# Altium schematic sheet 5-POWER.SchDoc
size A3
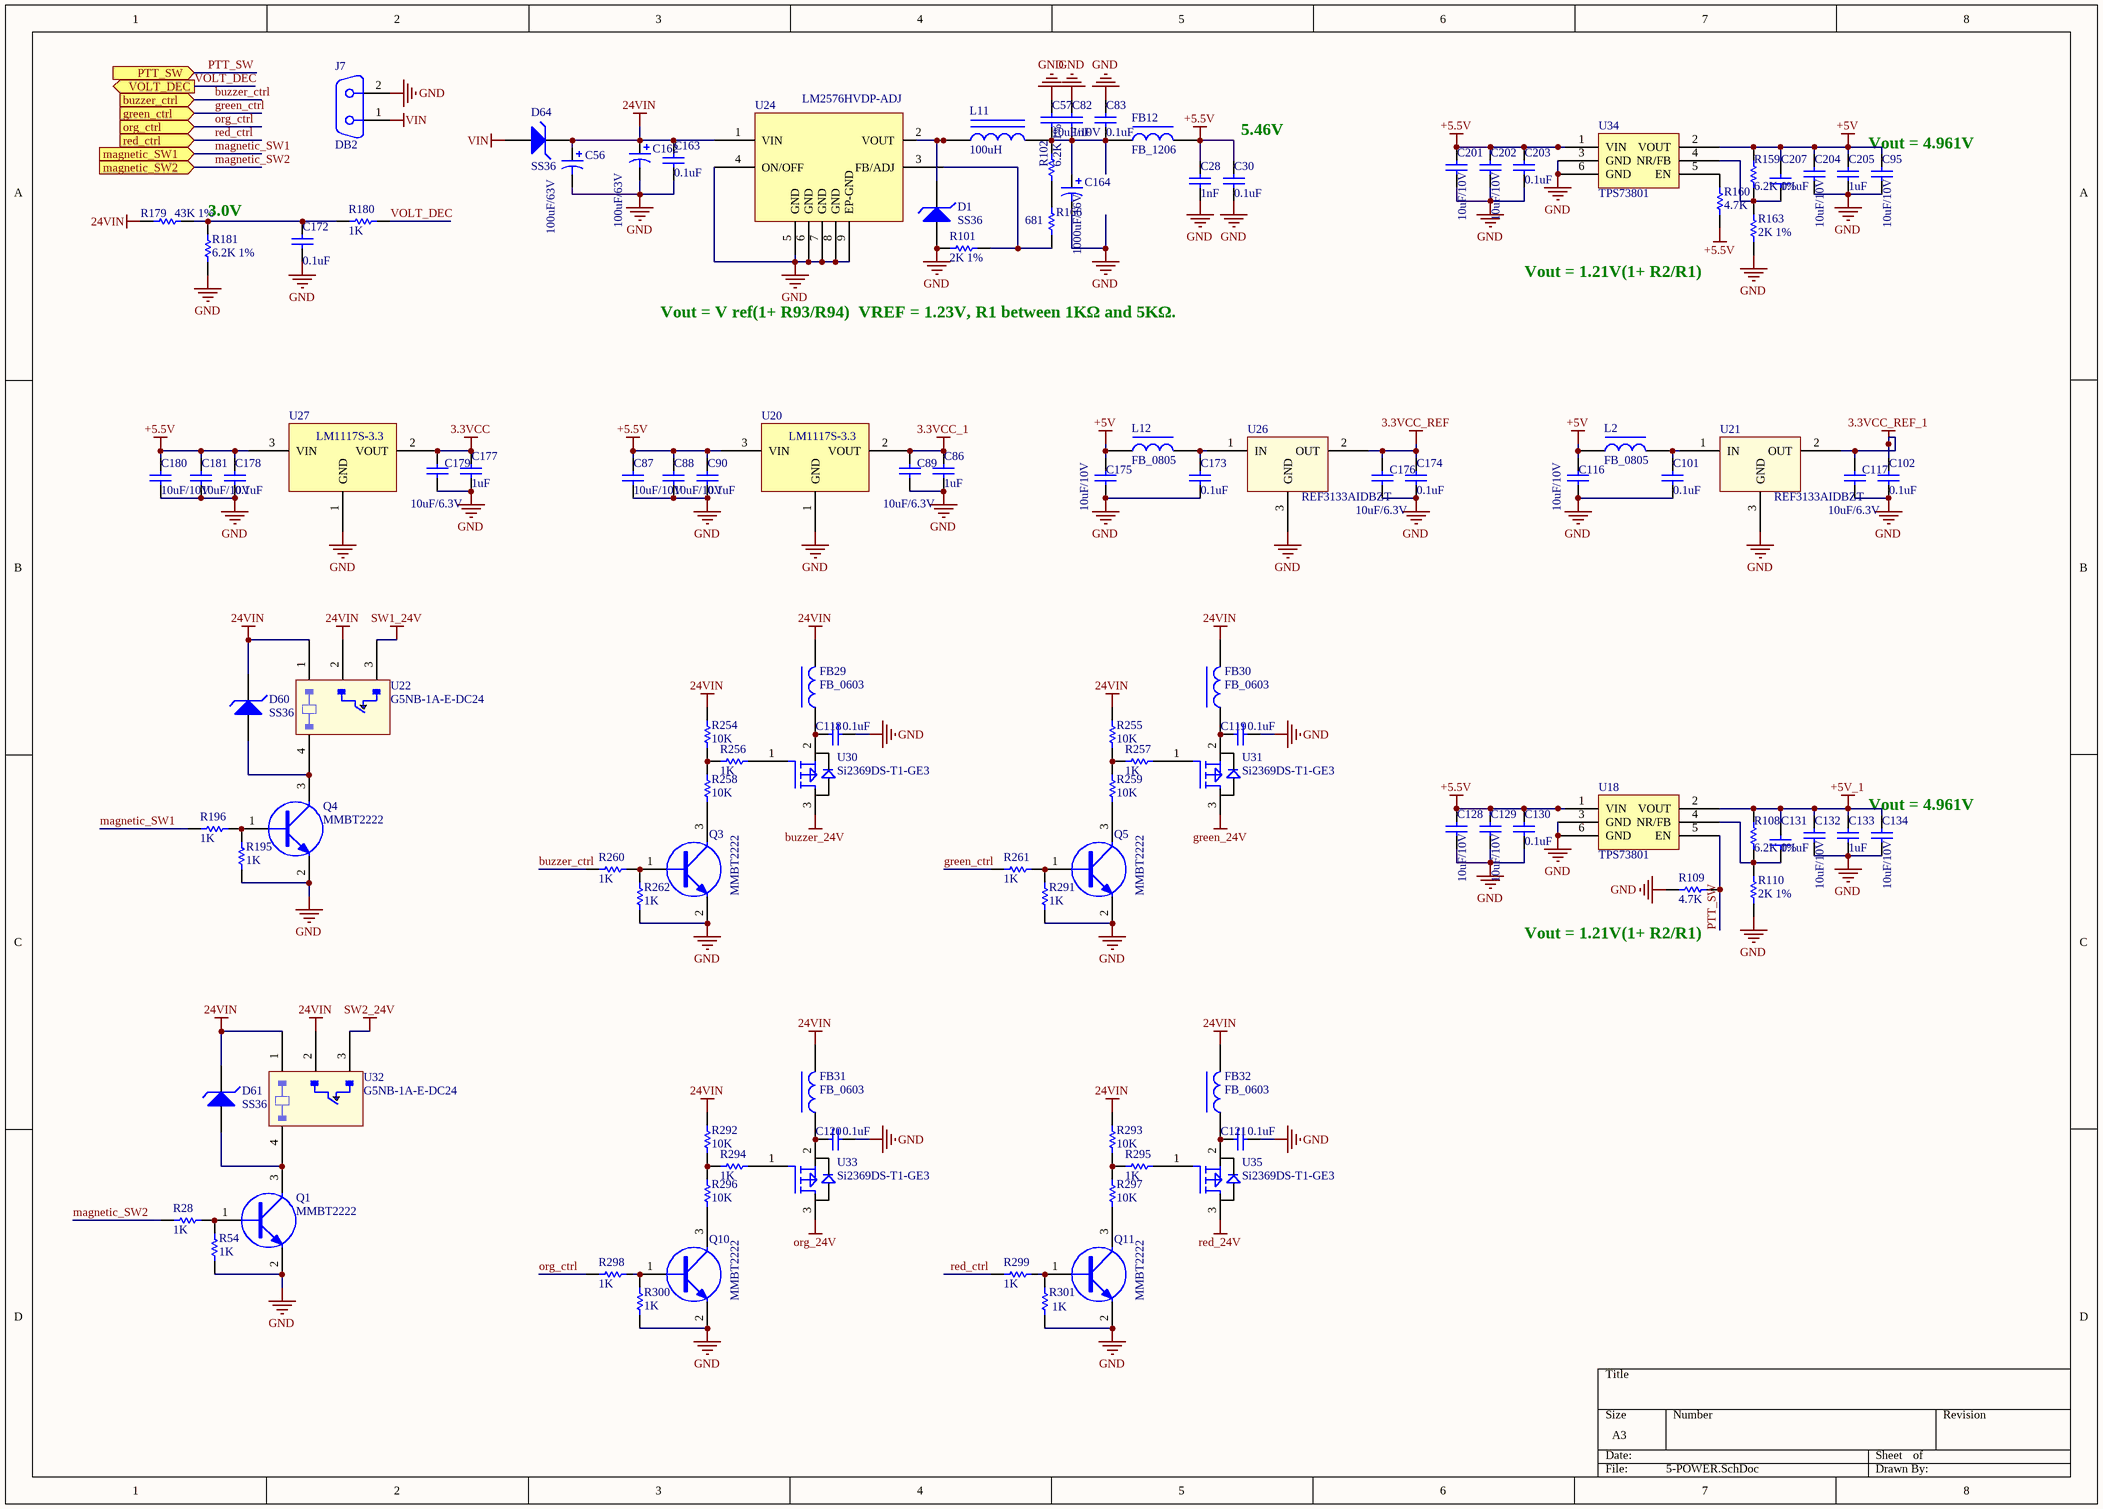
[diagram p0: 5-POWER.SchDoc]

## Parts
C28  1nF  [C0603]
C30  0.1uF  [C0603]
C56  100uF/63V  [ECAP2SM_10R4x10R4]
C57  10uF/10V  [C0805]
C82  1nF  [C0603]
C83  0.1uF  [C0603]
C86  1uF  [C0603]
C87  10uF/10V  [C0805]
C88  10uF/10V  [C0805]
C89  10uF/6.3V  [C0603]
C90  0.1uF  [C0603]
C95  10uF/10V  [C0805]
C101  0.1uF  [C0603]
C102  0.1uF  [C0603]
C116  10uF/10V  [C0805]
C117  10uF/6.3V  [C0603]
C118  0.1uF  [C0603]
C119  0.1uF  [C0603]
C120  0.1uF  [C0603]
C121  0.1uF  [C0603]
C128  10uF/10V  [C0805]
C129  10uF/10V  [C0805]
C130  0.1uF  [C0603]
C131  0.1uF  [C0603]
C132  10uF/10V  [C0805]
C133  1uF  [C0603]
C134  10uF/10V  [C0805]
C162  100uF/63V  [ECAP2SM_10R4x10R4]
C163  0.1uF  [C0603]
C164  1000uF/16V  [ECAP2SM_10R4x10R4]
C172  0.1uF  [C0603]
C173  0.1uF  [C0603]
C174  0.1uF  [C0603]
C175  10uF/10V  [C0805]
C176  10uF/6.3V  [C0603]
C177  1uF  [C0603]
C178  0.1uF  [C0603]
C179  10uF/6.3V  [C0603]
C180  10uF/10V  [C0805]
C181  10uF/10V  [C0805]
C201  10uF/10V  [C0805]
C202  10uF/10V  [C0805]
C203  0.1uF  [C0603]
C204  10uF/10V  [C0805]
C205  1uF  [C0603]
C207  0.1uF  [C0603]
D1  SS36  [DO-214AC]
D60  SS36  [DO-214AC]
D61  SS36  [DO-214AC]
D64  SS36  [DO-214AC]
FB12  FB_1206  [L1206]
FB29  FB_0603  [L0603]
FB30  FB_0603  [L0603]
FB31  FB_0603  [L0603]
FB32  FB_0603  [L0603]
J7  DB2  [DB2TM-VM]  (no BOM)
L2  FB_0805  [L0805]
L11  100uH  [PL2SM-12R5x12R5]
L12  FB_0805  [L0805]
Q1  MMBT2222  [SOT23-3]
Q3  MMBT2222  [SOT23-3]
Q4  MMBT2222  [SOT23-3]
Q5  MMBT2222  [SOT23-3]
Q10  MMBT2222  [SOT23-3]
Q11  MMBT2222  [SOT23-3]
R28  1K  [R0603]
R54  1K  [R0603]
R101  2K 1%  [R0603]
R102  6.2K 1%  [R0603]
R108  6.2K 1%  [R0603]
R109  4.7K  [R0603]
R110  2K 1%  [R0603]
R159  6.2K 1%  [R0603]
R160  4.7K  [R0603]
R163  2K 1%  [R0603]
R166  681  [R0603]
R179  43K 1%  [R0603]
R180  1K  [R0603]
R181  6.2K 1%  [R0603]
R195  1K  [R0603]
R196  1K  [R0603]
R254  10K  [R0603]
R255  10K  [R0603]
R256  1K  [R0603]
R257  1K  [R0603]
R258  10K  [R0603]
R259  10K  [R0603]
R260  1K  [R0603]
R261  1K  [R0603]
R262  1K  [R0603]
R291  1K  [R0603]
R292  10K  [R0603]
R293  10K  [R0603]
R294  1K  [R0603]
R295  1K  [R0603]
R296  10K  [R0603]
R297  10K  [R0603]
R298  1K  [R0603]
R299  1K  [R0603]
R300  1K  [R0603]
R301  1K  [R0603]
U18  TPS73801  [SOT-223-6]
U20  LM1117S-3.3  [SOT-223]
U21  REF3133AIDBZT  [SOT23-3]
U22  G5NB-1A-E-DC24  [G5NB-1A-E-DC24-20R4X7]
U24  LM2576HVDP-ADJ  [SOIC8_1R27_3R9x4R9-1]
U26  REF3133AIDBZT  [SOT23-3]
U27  LM1117S-3.3  [SOT-223]
U30  Si2369DS-T1-GE3  [SOT23-3]
U31  Si2369DS-T1-GE3  [SOT23-3]
U32  G5NB-1A-E-DC24  [G5NB-1A-E-DC24-20R4X7]
U33  Si2369DS-T1-GE3  [SOT23-3]
U34  TPS73801  [SOT-223-6]
U35  Si2369DS-T1-GE3  [SOT23-3]

## Ports
buzzer_ctrl (in), green_ctrl (in), magnetic_SW1 (in), magnetic_SW2 (in), org_ctrl (in), PTT_SW (in), red_ctrl (in), VOLT_DEC (out)

## Nets
3.3VCC: C177.2 C179.2 U27.2(VOUT)
3.3VCC_1: C86.2 C89.2 U20.2(VOUT)
3.3VCC_REF: C174.2 C176.2 U26.2(OUT)
3.3VCC_REF_1: C102.2 C117.2 U21.2(OUT)
24VIN: C56.1 C162.1 C163.2 D60.2(K) D61.2(K) D64.2(K) FB29.2 FB30.2 FB31.2 FB32.2 R179.1 R254.2 R255.2 R292.2 R293.2 U22.1 U22.2 U24.1(VIN) U32.1 U32.2
+5.5V: C28.2 C30.2 C87.2 C88.2 C90.2 C128.2 C129.2 C130.2 C178.2 C180.2 C181.2 C201.2 C202.2 C203.2 FB12.2 R160.2 U18.1(VIN) U20.3(VIN) U27.3(VIN) U34.1(VIN)
+5V: C95.2 C116.2 C175.2 C204.2 C205.2 C207.2 L2.1 L12.1 R159.2 U34.2(VOUT)
+5V_1: C131.2 C132.2 C133.2 C134.2 R108.2 U18.2(VOUT)
buzzer_24V: U30.3(D)
GND: C28.1 C30.1 C56.2 C57.2 C82.2 C83.2 C86.1 C87.1 C88.1 C89.1 C90.1 C95.1 C101.1 C102.1 C116.1 C117.1 C118.1 C119.1 C120.1 C121.1 C128.1 C129.1 C130.1 C132.1 C133.1 C134.1 C162.2 C163.1 C164.2 C172.1 C173.1 C174.1 C175.1 C176.1 C177.1 C178.1 C179.1 C180.1 C181.1 C201.1 C202.1 C203.1 C204.1 C205.1 D1.1(A) J7.2 Q1.2(E) Q3.2(E) Q4.2(E) Q5.2(E) Q10.2(E) Q11.2(E) R54.1 R101.2 R109.1 R110.1 R163.1 R181.1 R195.1 R262.2 R291.2 R300.2 R301.2 U18.3(GND) U18.6(GND) U20.1(GND) U21.3(GND) U24.4(ON/OFF) U24.5(GND) U24.6(GND) U24.7(GND) U24.8(GND) U24.9(EP-GND) U26.3(GND) U27.1(GND) U34.3(GND) U34.6(GND)
green_24V: U31.3(D)
org_24V: U33.3(D)
red_24V: U35.3(D)
SW1_24V: U22.3
SW2_24V: U32.3
VIN: D64.1(A) J7.1
buzzer_ctrl: R260.1 ; port buzzer_ctrl
green_ctrl: R261.1 ; port green_ctrl
magnetic_SW1: R196.1 ; port magnetic_SW1
magnetic_SW2: R28.1 ; port magnetic_SW2
org_ctrl: R298.1 ; port org_ctrl
PTT_SW: R109.2 U18.5(EN) ; port PTT_SW
red_ctrl: R299.1 ; port red_ctrl
VOLT_DEC: R180.1 ; port VOLT_DEC
NetC57_1: C57.1 C82.1 C83.1 C164.1 FB12.1 L11.2 R102.2
NetC101_2: C101.2 L2.2 U21.1(IN)
NetC118_2: C118.2 FB29.1 U30.2(S)
NetC119_2: C119.2 FB30.1 U31.2(S)
NetC120_2: C120.2 FB31.1 U33.2(S)
NetC121_2: C121.2 FB32.1 U35.2(S)
NetC131_1: C131.1 R108.1 R110.2 U18.4(NR/FB)
NetC172_2: C172.2 R179.2 R180.2 R181.2
NetC173_2: C173.2 L12.2 U26.1(IN)
NetC207_1: C207.1 R159.1 R163.2 U34.4(NR/FB)
NetD1_2: D1.2(K) L11.1 U24.2(VOUT)
NetD60_1: D60.1(A) Q4.3(C) U22.4
NetD61_1: D61.1(A) Q1.3(C) U32.4
NetQ1_1: Q1.1(B) R28.2 R54.2
NetQ3_1: Q3.1(B) R260.2 R262.1
NetQ3_3: Q3.3(C) R258.1
NetQ4_1: Q4.1(B) R195.2 R196.2
NetQ5_1: Q5.1(B) R261.2 R291.1
NetQ5_3: Q5.3(C) R259.1
NetQ10_1: Q10.1(B) R298.2 R300.1
NetQ10_3: Q10.3(C) R296.1
NetQ11_1: Q11.1(B) R299.2 R301.1
NetQ11_3: Q11.3(C) R297.1
NetR101_1: R101.1 R166.1 U24.3(FB/ADJ)
NetR102_1: R102.1 R166.2
NetR160_1: R160.1 U34.5(EN)
NetR254_1: R254.1 R256.1 R258.2
NetR255_1: R255.1 R257.1 R259.2
NetR256_2: R256.2 U30.1(G)
NetR257_2: R257.2 U31.1(G)
NetR292_1: R292.1 R294.1 R296.2
NetR293_1: R293.1 R295.1 R297.2
NetR294_2: R294.2 U33.1(G)
NetR295_2: R295.2 U35.1(G)

## Notes on the sheet
- 5.46V
- (near C95) Vout = 4.961V
- (near R181) 3.0V
- Vout = V ref(1+ R93/R94)  VREF = 1.23V, R1 between 1KΩ and 5KΩ.
- Vout = 1.21V(1+ R2/R1)
- (near C134) Vout = 4.961V

## Library data of the parts
C28 C82 = 1000pF贴片电容: 贴片电容_GRM188R71H102KA01_1000pF±10%,50V,0603; code: 01010093
C30 C83 C118-C121 = 0.1uF: GRM188R71H104KA01D; MPN: MURATA; WSPN: 01010045
C56 C162 = 100uF/63V电解电容: 电解电容_VEJ101M1JTR-1010_100uF/63V,±20%,表贴10*10; code: 01080002
C57 C87 C88 C95 C116 C128 C129 C132 C134 C175 C180 C181 C201 C202 C204 = 10uF贴片电容: 贴片电容_GRM21BR61A106KE19L_10uF±10%,10V,0805; code: 01010036
C86 C133 C177 C205 = 1uF贴片电容: 贴片电容_GRM188R61A105KA61D_1uF±10%,10V,0603; code: 01010038
C89 C117 C176 C179 = 10uF贴片电容: 贴片电容_GRM188R60J106ME47D_10uF±20%,6.3V,0603; code: 01010037
C90 C101 C102 C130 C131 C163 C172-C174 C178 C203 C207 = 0.1uF贴片电容: 贴片电容_GRM188R71H104KA01D_0.1uF±10%,50V,0603; code: 01010045
C164 = 1000uF/16V电解电容: 电解电容_VE102M1CTR-1010_1000uF/16V,±20%,表贴10*10; code: 01080003
D1 D60 D61 D64 = 肖特基整流二极管_SS36: 肖特基整流二极管_SS36_封装SMA,3A/60V; code: 01040003
FB12 = 1206贴片磁珠: 贴片磁珠_30R,6A,1206; code: 0103015
FB29-FB32 = 0603贴片磁珠: 贴片磁珠_100R,0603; code: 0103016
J7 = DB2公头座子: 连接器_DB2公头,电源接头; code: 0207001
L2 L12 = 0805贴片磁珠: 贴片磁珠_600R,0805; code: 01030023
L11 = 100uH贴片功率电感: 贴片功率电感_SLF12575T-101M1R9-PF_100uH±20%,额定电流1.9A,12.5x12.5; code: 01030003
Q1 Q3-Q5 Q10 Q11 = MMBT2222: NPN三极管_MMBT2222_表贴SOT23; code: 01050001
R28 R54 R180 R195 R196 R254-R262 R291-R301 = 1K贴片电阻: 贴片电阻_1K±5%,0603; code: 01020082
R101 R110 R163 = 2K贴片电阻: 贴片电阻_2K±5%,0603; code: 01020086
R102 R108 R159 = 6.2K贴片电阻: 贴片电阻_6.2K±5%,0603; code: 01020106
R109 R160 = 4.7K贴片电阻: 贴片电阻_4.7K±5%,0603; code: 01020012
R166 = 1.5K贴片电阻: 0603,681Ω,±1％; code: 01020063
R179 = 12.4K贴片电阻: 贴片电阻_12.4K±1%,0603; code: 01020125
R181 = 1.5K贴片电阻: 贴片电阻_1.5K±5%,0603; code: 01020063
U18 U34 = TPS73701DCQ: LDO_TPS73701DCQ_1A输出,SOT223-6; Maker: TI; code: *
U20 U27 = LM1117S-3.3: LDO_LM1117S-3.3_1A输出,SOT223; code: 01060031
U21 U26 = REF3133AIDBZT: LDO_REF3133AIDBZT_3.3V输出,10mA输出,SOT23-3; Maker: TI; code: 01060034
U22 U32 = G5NB-1A-E-DC24: 继电器_G5NB-1A-E-DC24
U24 = LM2576HVDP-ADJ: 稳压集成电路_LM2576HVDP-ADJ_3A输出,SOIC8; code: 03020005; Maker: HTC
U30 U31 U33 U35 = Si2369DS-T1-GE3: P-MOS_Si2369DS-T1-GE3_SOT23; code: 01060087